# EasyEDA schematic SCH_Hormann Garage Door_2023-03-31.json
TITLE: Sheet_1; REV: 1.0; Date: 2023-02-03; Sheet: 1/1; Drawn By: vladimir.zrnic; Company: Your Company
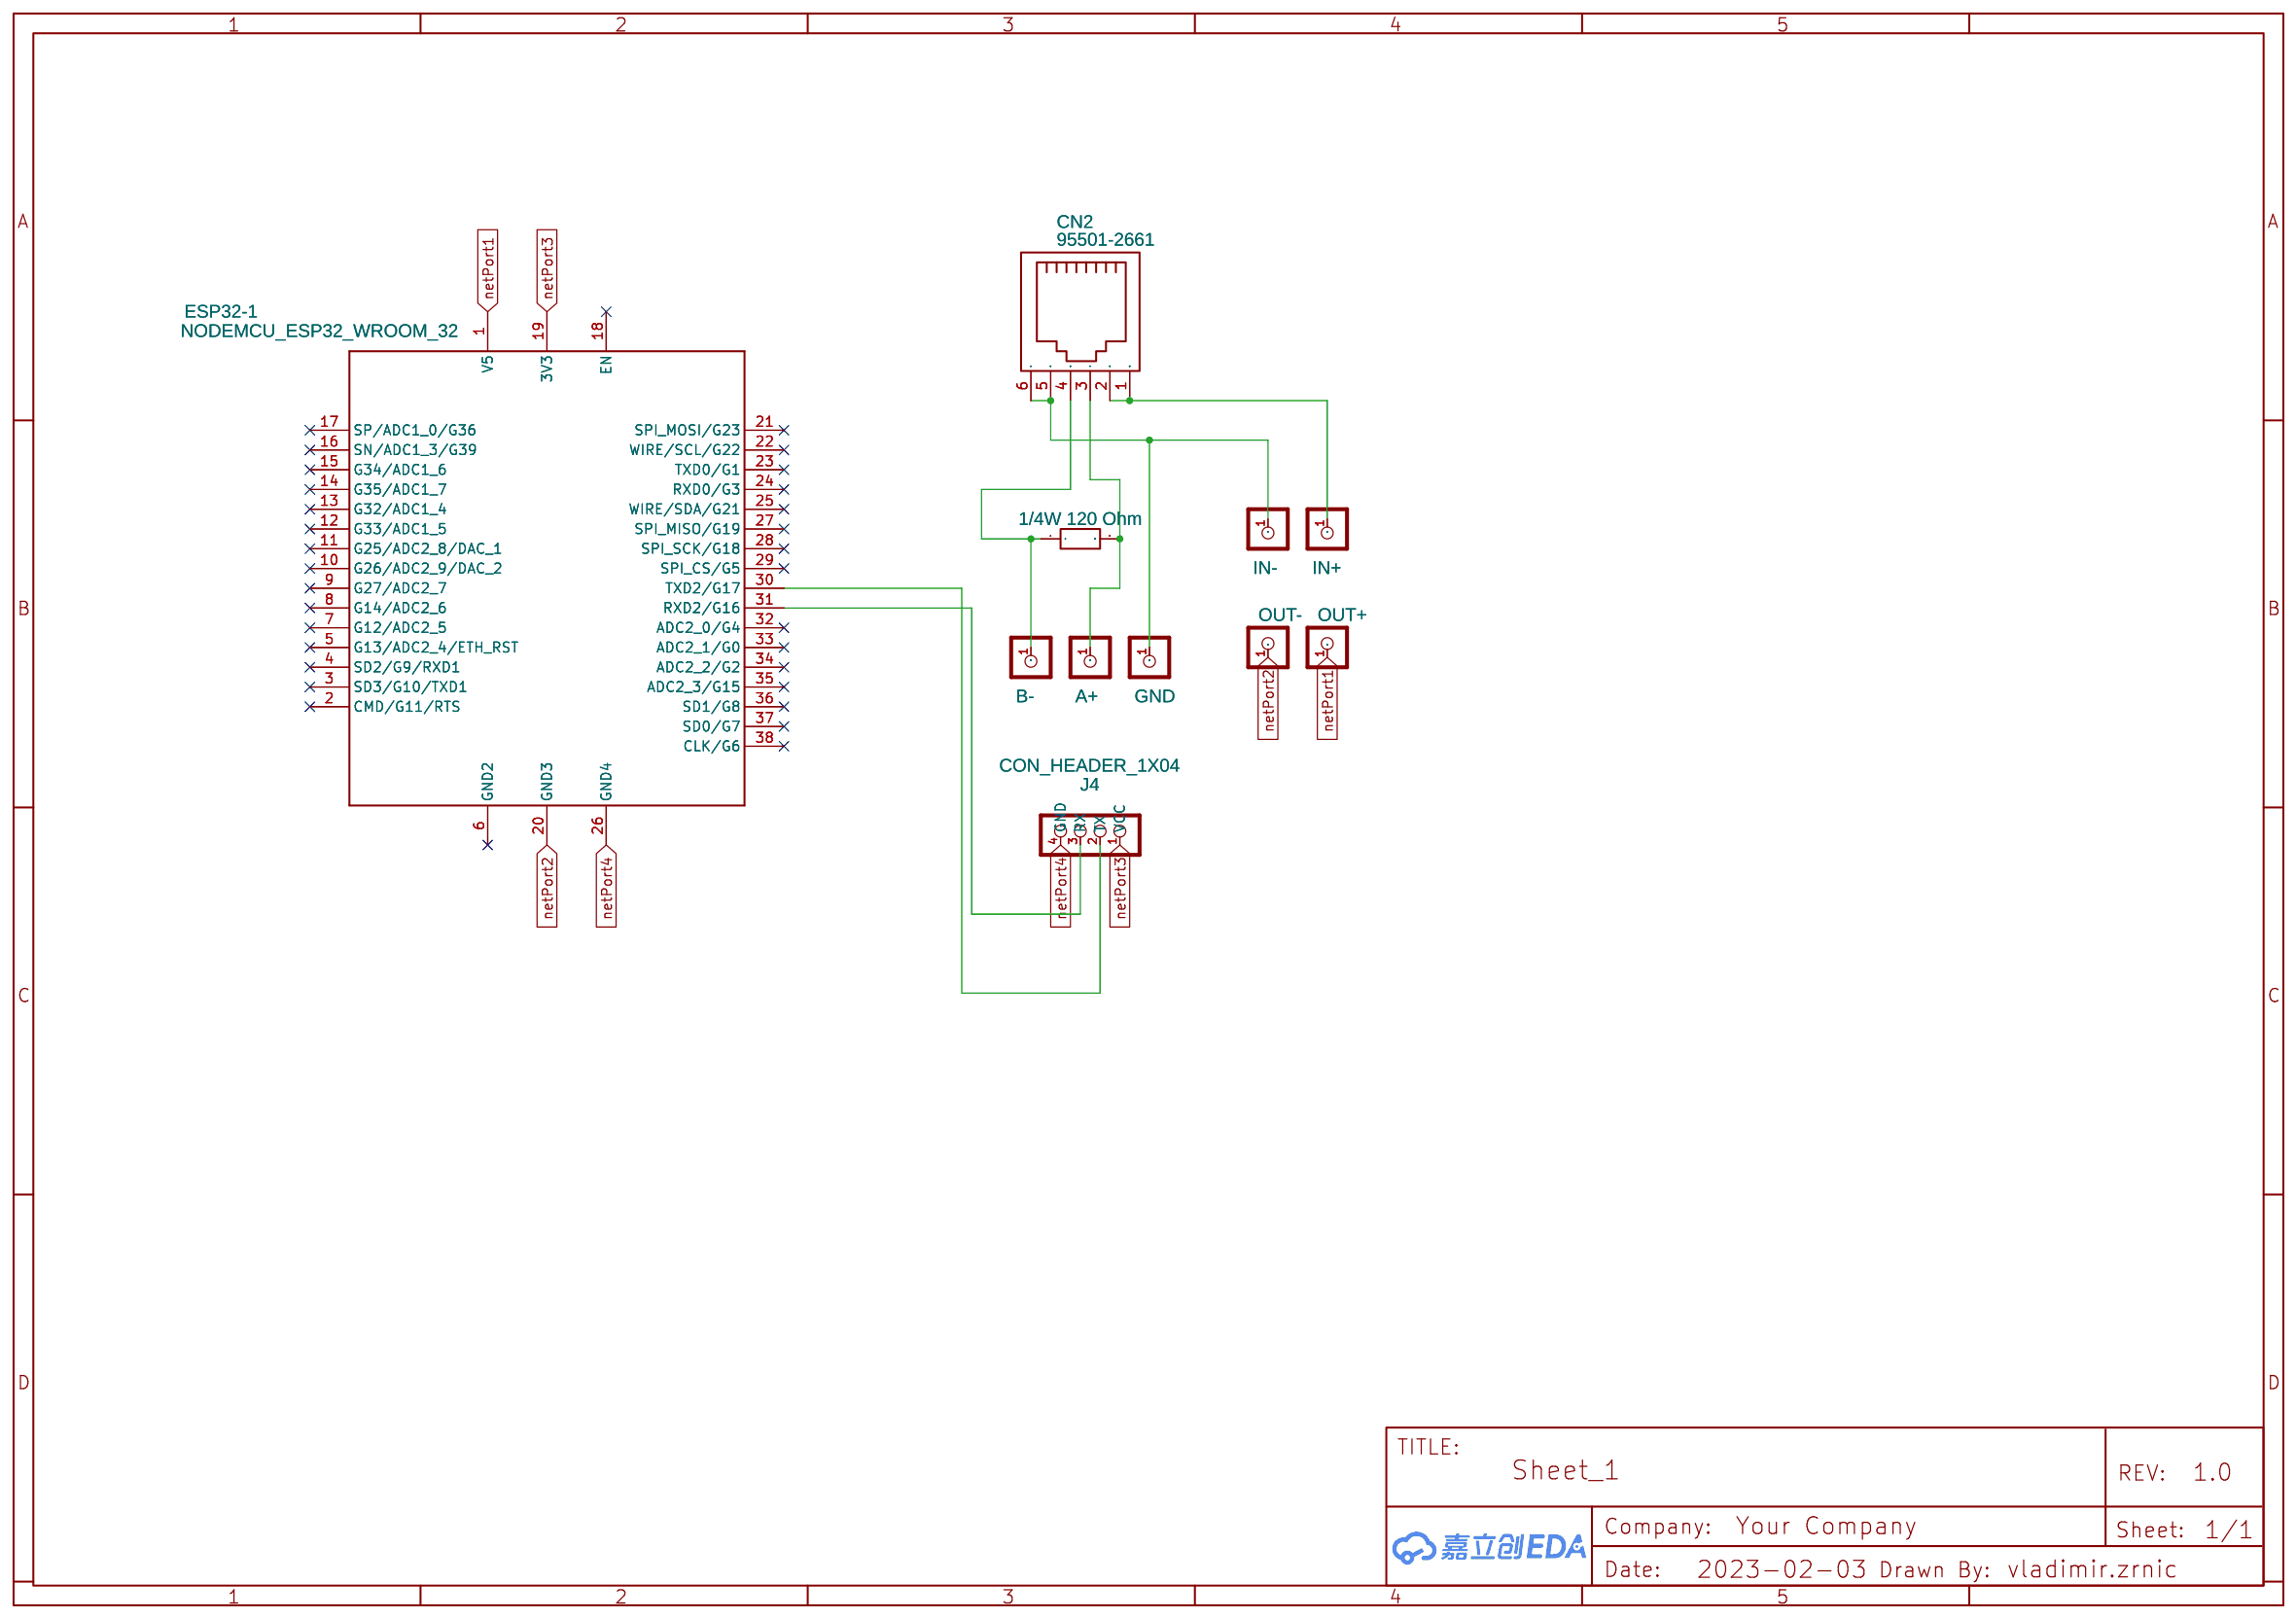
[diagram p0: schematic sheet]

## Parts
CN2  95501-2661  [RJ12-TH_95501-2661]
ESP32-1  NODEMCU_ESP32_WROOM_32  [NODEMCU_ESP32_WROOM_32--38PINS]
J1  B-  [M1X1]
J2  A+  [M1X1]
J3  GND  [M1X1]
J4  CON_HEADER_1X04  [M1X4]
J5  IN-  [M1X1]
J6  IN+  [M1X1]
J7  OUT+  [M1X1]
J8  OUT-  [M1X1]
U2  1/4W 120 Ohm  [RESISTOR1/4W]

## Library data of the parts
CN2 = 95501-2661: Supplier: LCSC; Supplier Part: C240856; Manufacturer: MOLEX; Contributor: LCSC; JLCPCB Part Class: Extended Part; Package Display: No
ESP32-1 = NODEMCU_ESP32_WROOM_32: Contributor: Washington Kamadi
J1-J3 J5-J8 = CON_HEADER_1X01: Contributor: DangerousPrototype
J4 = CON_HEADER_1X04: Contributor: DangerousPrototype; Package Display: No
U2 = RESISTOR1/4W COPY COPY COPY: Contributor: Lorenzo Delana

## Nets
netPort1: ESP32-1.1(V5) J7.1
netPort2: ESP32-1.20(GND3) J8.1
netPort3: ESP32-1.19(3V3) J4.1(VCC)
netPort4: ESP32-1.26(GND4) J4.4(GND)
Net-(CN2-1): CN2.1(6) CN2.2(5) J6.1
Net-(CN2-3): CN2.3(4) J2.1 U2.2
Net-(CN2-4): CN2.4(3) J1.1 U2.1
Net-(CN2-5): CN2.5(2) CN2.6(1) J3.1 J5.1
Net-(ESP32-1-30): ESP32-1.30(TXD2/G17) J4.2(TX)
Net-(ESP32-1-31): ESP32-1.31(RXD2/G16) J4.3(RX)

Not connected (* = marked no-connect by the designer): ESP32-1 2(CMD/G11/RTS)* 3(SD3/G10/TXD1)* 4(SD2/G9/RXD1)* 5(G13/ADC2_4/ETH_RST)* 6(GND2)* 7(G12/ADC2_5)* 8(G14/ADC2_6)* 9(G27/ADC2_7)* 10(G26/ADC2_9/DAC_2)* 11(G25/ADC2_8/DAC_1)* 12(G33/ADC1_5)* 13(G32/ADC1_4)* 14(G35/ADC1_7)* 15(G34/ADC1_6)* 16(SN/ADC1_3/G39)* 17(SP/ADC1_0/G36)* 18(EN)* 21(SPI_MOSI/G23)* 22(WIRE/SCL/G22)* 23(TXD0/G1)* 24(RXD0/G3)* 25(WIRE/SDA/G21)* 27(SPI_MISO/G19)* 28(SPI_SCK/G18)* 29(SPI_CS/G5)* 32(ADC2_0/G4)* 33(ADC2_1/G0)* 34(ADC2_2/G2)* 35(ADC2_3/G15)* 36(SD1/G8)* 37(SD0/G7)* 38(CLK/G6)*
